# EAGLE design RFID_Lock_PCB (EAGLE 9.4.2)
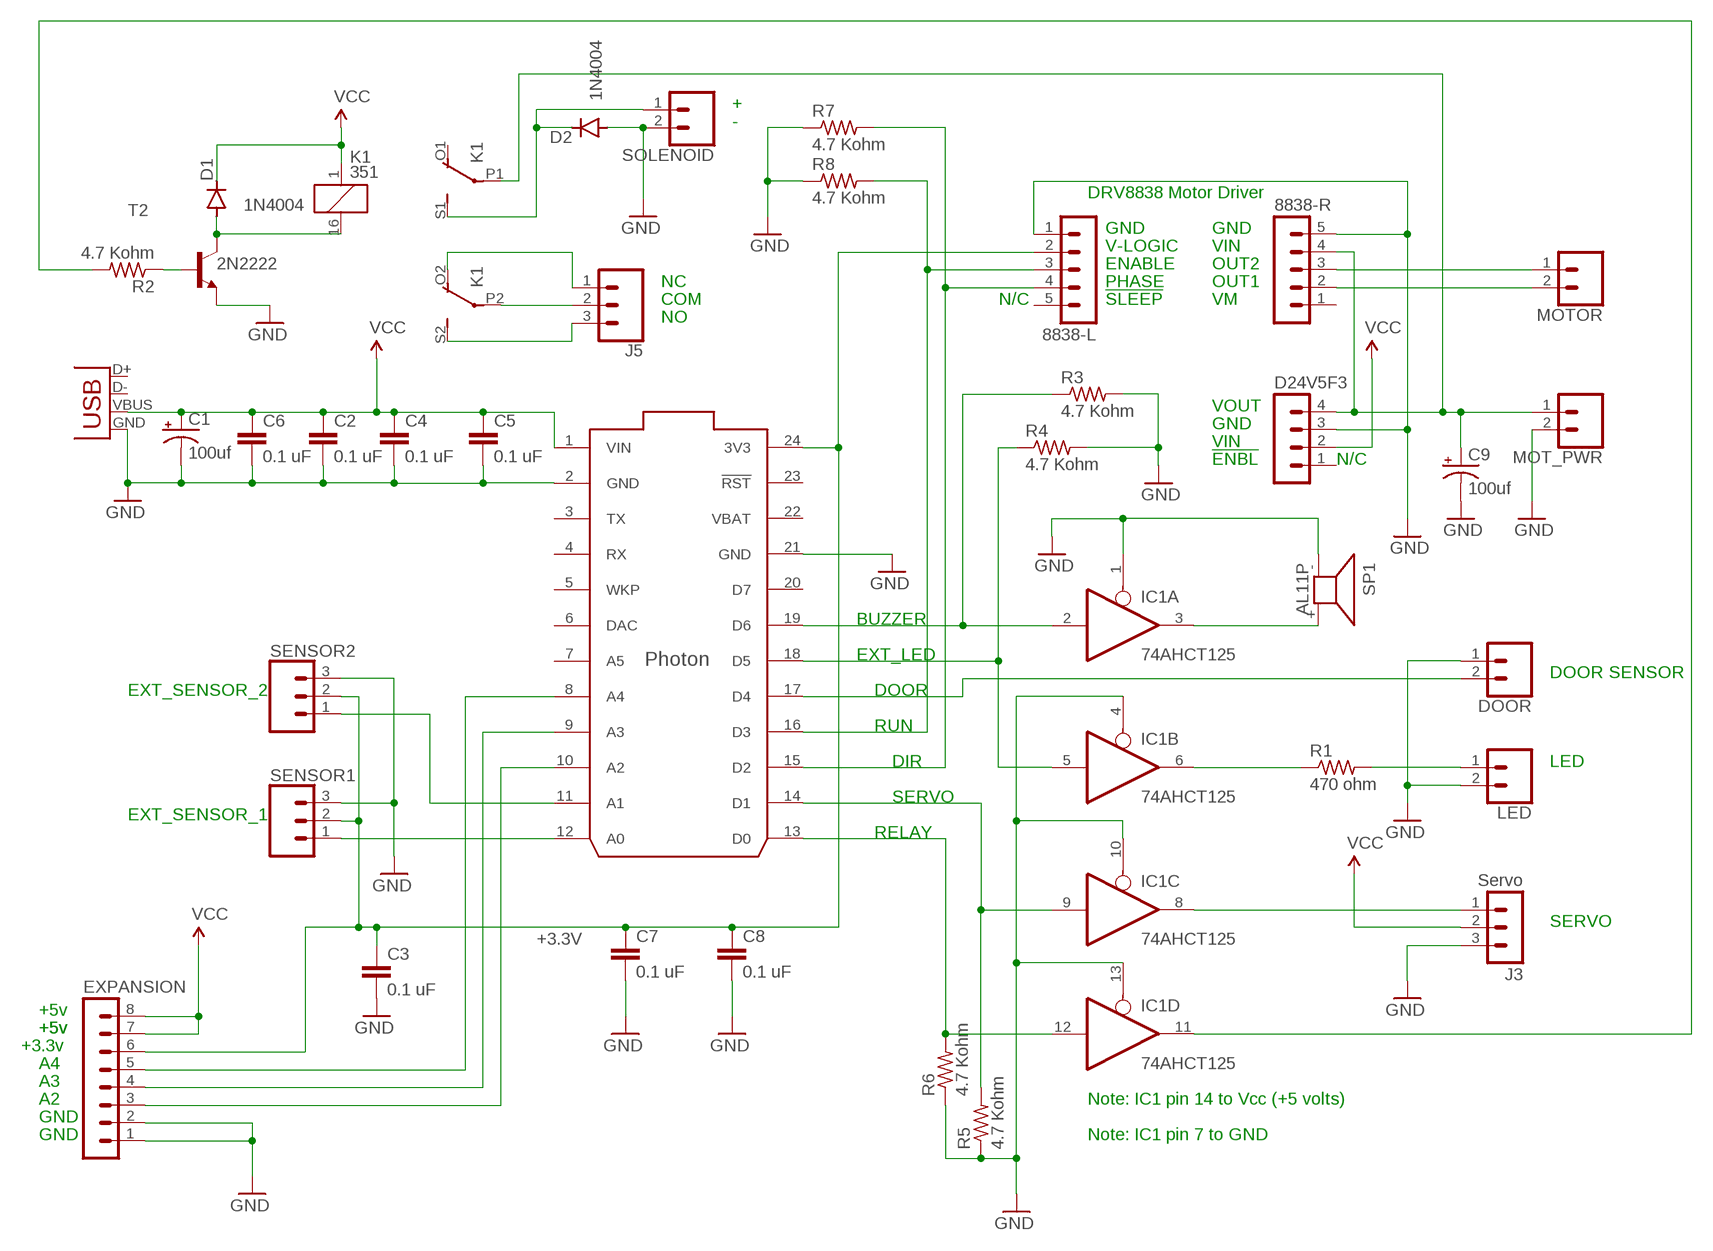
[diagram p0: schematic, sheet 1]

## Parts
8838-L  MA05-1  [MA05-1]
8838-R  MA05-1  [MA05-1]
C1  100uf  CAP_POLPTH1  [CPOL-RADIAL-100UF-25V]
C2  0.1 uF  CAPPTH  [CAP-PTH-SMALL]
C3  0.1 uF  CAPPTH  [CAP-PTH-SMALL]
C4  0.1 uF  CAPPTH  [CAP-PTH-SMALL]
C5  0.1 uF  CAPPTH  [CAP-PTH-SMALL]
C6  0.1 uF  CAPPTH  [CAP-PTH-SMALL]
C7  0.1 uF  CAPPTH  [CAP-PTH-SMALL]
C8  0.1 uF  CAPPTH  [CAP-PTH-SMALL]
C9  100uf  CAP_POLPTH1  [CPOL-RADIAL-100UF-25V]
D1  1N4004  [DO41-10]
D2  1N4004  [DO41-10]
D24V5F3  MA04-1  [MA04-1]
DOOR  CONN_023.5MM  [SCREWTERMINAL-3.5MM-2]
EXPANSION  MA08-1  [MA08-1]
IC1  74AHCT125  74125N  [DIL14]
J3  Servo  MA03-1  [MA03-1]
J5  CONN_03SCREW  [SCREWTERMINAL-3.5MM-3]
JP1  USB-B  USBPTH  [USB-B-PTH]
K1  351  [351]
LED  CONN_023.5MM  [SCREWTERMINAL-3.5MM-2]
MOT_PWR  CONN_023.5MM  [SCREWTERMINAL-3.5MM-2]
MOTOR  CONN_023.5MM  [SCREWTERMINAL-3.5MM-2]
R1  470 ohm  R-US_0309/12  [0309/12]
R2  4.7 Kohm  R-US_0309/12  [0309/12]
R3  4.7 Kohm  R-US_0309/12  [0309/12]
R4  4.7 Kohm  R-US_0309/12  [0309/12]
R5  4.7 Kohm  R-US_0309/12  [0309/12]
R6  4.7 Kohm  R-US_0309/12  [0309/12]
R7  4.7 Kohm  R-US_0309/12  [0309/12]
R8  4.7 Kohm  R-US_0309/12  [0309/12]
SENSOR1  CONN_03SCREW  [SCREWTERMINAL-3.5MM-3]
SENSOR2  CONN_03SCREW  [SCREWTERMINAL-3.5MM-3]
SOLENOID  CONN_023.5MM  [SCREWTERMINAL-3.5MM-2]
SP1  AL11P  [AL11P]
T2  2N2222  [TO92-EBC-OVAL]
U$1  PHOTON_WITH_HEADERS  [PHOTON]

## Nets
+3.3V: 8838-L.2 C3.1 C7.1 C8.1 EXPANSION.6 SENSOR1.2 SENSOR2.2 U$1.24(3V3)
GND: 8838-L.1 8838-R.5 C1.2(-) C2.2 C3.2 C4.2 C5.2 C6.2 C7.2 C8.2 C9.2(-) D2.A D24V5F3.3 DOOR.1 EXPANSION.1 EXPANSION.2 IC1.1(A:OE) IC1.4(B:OE) IC1.10(C:OE) IC1.13(D:OE) J3.3 JP1.GND LED.2 MOT_PWR.2 R3.2 R4.2 R5.1 R6.1 R7.1 R8.1 SENSOR1.3 SENSOR2.3 SOLENOID.2 SP1.- T2.E U$1.2(GND) U$1.21(GND)
N$1: IC1.8(C:O) J3.1
N$2: SENSOR2.1 U$1.11(A1)
N$3: SENSOR1.1 U$1.12(A0)
N$4: IC1.2(A:I) R3.1 U$1.19(D6)
N$5: 8838-L.3 R8.2 U$1.16(D3)
N$6: 8838-R.4 C9.1(+) D24V5F3.4 K1.P1(2:P) MOT_PWR.1
N$7: IC1.9(C:I) R5.2 U$1.14(D1)
N$8: 8838-R.3 MOTOR.1
N$9: IC1.6(B:O) R1.1
N$10: LED.1 R1.2
N$11: DOOR.2 U$1.17(D4)
N$12: 8838-L.4 R7.2 U$1.15(D2)
N$13: 8838-R.2 MOTOR.2
N$14: IC1.3(A:O) SP1.+
N$15: EXPANSION.3 U$1.10(A2)
N$16: EXPANSION.4 U$1.9(A3)
N$17: IC1.12(D:I) R6.2 U$1.13(D0)
N$18: EXPANSION.5 U$1.8(A4)
N$19: IC1.11(D:O) R2.2
N$20: R2.1 T2.B
N$21: D1.A K1.16 T2.C
N$22: D2.C K1.S1(2:S) SOLENOID.1
N$23: IC1.5(B:I) R4.1 U$1.18(D5)
N$26: J5.2 K1.P2(3:P)
N$27: J5.1 K1.O2(3:O)
N$28: J5.3 K1.S2(3:S)
VCC: C1.1(+) C2.1 C4.1 C5.1 C6.1 D1.C D24V5F3.2 EXPANSION.7 EXPANSION.8 J3.2 JP1.VBUS K1.1 U$1.1(VIN)
Unconnected: 8838-L.5 8838-R.1 D24V5F3.1 JP1.D+ JP1.D- K1.O1(2:O) U$1.3(TX) U$1.4(RX) U$1.5(WKP) U$1.6(DAC) U$1.7(A5) U$1.20(D7) U$1.23(!RST)

## Notes on the sheet
- +
- -
- DRV8838 Motor Driver
- GND | GND
- V-LOGIC | VIN
- ENABLE | OUT2
- NC | PHASE | OUT1
- COM | N/C | !SLEEP | VM
- NO
- VOUT
- GND
- VIN
- !ENBL | N/C
- BUZZER
- EXT_LED
- DOOR SENSOR
- EXT_SENSOR_2 | DOOR
- RUN
- DIR | LED
- SERVO
- EXT_SENSOR_1
- RELAY
- SERVO
- +5v
- +5v | +5v
- +3.3v
- A4
- A3
- A2 | Note: IC1 pin 14 to Vcc (+5 volts)
- GND
- GND | Note: IC1 pin 7 to GND

## Power pins joined to a net without a drawn wire
GND: IC1.7(P:GND)
VBAT: U$1.22(VBAT)
VCC: IC1.14(P:VCC)

## Library data of the parts
8838-L 8838-R = con-lstb:MA05-1: PIN HEADER; OC_FARNELL: unknown; OC_NEWARK: unknown
C1 C9 = SparkFun-Capacitors:CAP_POL: Capacitor Polarized These are standard SMD and PTH capacitors. Normally 10uF, 47uF, and 100uF in electrolytic and tantalum varieties. Always verify the external diameter of the through hole cap, it varies with capacity, voltage, and manufacturer. The EIA devices should be standard.
C2-C8 = SparkFun-Passives:CAP: Capacitor Standard 0603 ceramic capacitor, and 0.1" leaded capacitor.
D1 D2 = diode:1N4004: DIODE general purpose rectifier, 1 A
D24V5F3 = con-lstb:MA04-1: PIN HEADER; OC_FARNELL: unknown; OC_NEWARK: unknown
DOOR LED MOT_PWR MOTOR SOLENOID = SparkFun-Connectors:CONN_02: Multi connection point. Often used as Generic Header-pin footprint for 0.1 inch spaced/style header connections On any of the 0.1 inch spaced packages, you can populate with these: Break Away Headers - Straight <https://www.sparkfun.com/products/116> (PRT-00116) Break Away Male Headers - Right Angle <https://www.sparkfun.com/products/553> (PRT-00553) Female Headers <https://www.sparkfun.com/products/115> (PRT-00115) Break Away Headers - Machine Pin <https://www.sparkfun.com/products/117> (PRT-00117) Break Away Female Headers - Swiss Machine Pin <https://www.sparkfun.com/products/743> (PRT-00743) For SCREWTERMINALS and SPRING TERMINALS visit here: Screw Terimnals on SparkFun.com <https://www.sparkfun.com/search/results?term=Screw+Terminals> (5mm/3.5mm/2.54mm spacing) This device is also useful as a general connection point to wire up your design to another part of your project. Our various solder wires solder well into these plated through hole pads. Hook-Up Wire - Assortment (Stranded, 22 AWG) <https://www.sparkfun.com/products/11375> (PRT-11375) Hook-Up Wire - Assortment (Solid Core, 22 AWG) <https://www.sparkfun.com/products/11367> (PRT-11367) View the entire wire category on our website here <https://www.sparkfun.com/categories/141> Special notes: Molex polarized connector foot print use with: PRT-08233 with associated crimp pins and housings. 2.54_SCREWTERM for use with PRT-10571. 3.5mm Screw Terminal footprints for PRT-08084 5mm Screw Terminal footprints for use with PRT-08432; PROD_ID: CONN-08399
EXPANSION = con-lstb:MA08-1: PIN HEADER; OC_FARNELL: unknown; OC_NEWARK: unknown
IC1 = 74xx-us:74*125: Quad bus BUFFER, 3-state
J3 = con-lstb:MA03-1: PIN HEADER; OC_FARNELL: unknown; OC_NEWARK: unknown
J5 SENSOR1 SENSOR2 = SparkFun-Connectors:CONN_03: Multi connection point. Often used as Generic Header-pin footprint for 0.1 inch spaced/style header connections On any of the 0.1 inch spaced packages, you can populate with these: Break Away Headers - Straight <https://www.sparkfun.com/products/116> (PRT-00116) Break Away Male Headers - Right Angle <https://www.sparkfun.com/products/553> (PRT-00553) Female Headers <https://www.sparkfun.com/products/115> (PRT-00115) Break Away Headers - Machine Pin <https://www.sparkfun.com/products/117> (PRT-00117) Break Away Female Headers - Swiss Machine Pin <https://www.sparkfun.com/products/743> (PRT-00743) Stackable Header - 3 Pin (Female, 0.1") <https://www.sparkfun.com/products/13875> (PRT-13875) For SCREWTERMINALS and SPRING TERMINALS visit here: Screw Terimnals on SparkFun.com <https://www.sparkfun.com/search/results?term=Screw+Terminals> (5mm/3.5mm/2.54mm spacing) This device is also useful as a general connection point to wire up your design to another part of your project. Our various solder wires solder well into these plated through hole pads. Hook-Up Wire - Assortment (Stranded, 22 AWG) <https://www.sparkfun.com/products/11375> (PRT-11375) Hook-Up Wire - Assortment (Solid Core, 22 AWG) <https://www.sparkfun.com/products/11367> (PRT-11367) View the entire wire category on our website here <https://www.sparkfun.com/categories/141> Special notes: Molex polarized connector foot print use with SKU : PRT-08232 with associated crimp pins and housings.; PROD_ID: CONN-08288; SF_ID: PRT-08235
JP1 = SparkFun-Connectors:USB: USB Connectors USB-B-PTH is fully proven SKU : PRT-00139/CONN-08278 USB-miniB is fully proven SKU : PRT-00587 USB-A-PCB is untested. USB-A-H is throughly reviewed, but untested. Spark Fun Electronics SKU : PRT-00437 USB-B-SMT is throughly reviewed, but untested. Needs silkscreen touching up. USB-A-S has not been used/tested USB-MB-H has not been used/tested USB-MICROB has been used. CONN-09505; PROD_ID: CONN-08278
K1 = relay:351: RELAY 2 x switch, Omron; OC_FARNELL: unknown; OC_NEWARK: unknown
R1-R8 = rcl:R-US_: RESISTOR, American symbol
SP1 = buzzer:AL11P: SPEAKER Source: Buerklin; OC_FARNELL: unknown; OC_NEWARK: unknown
T2 = adafruit:2N2222: NPN TRANSISTOR Big oval pads
U$1 = Spark:PHOTON

## Board
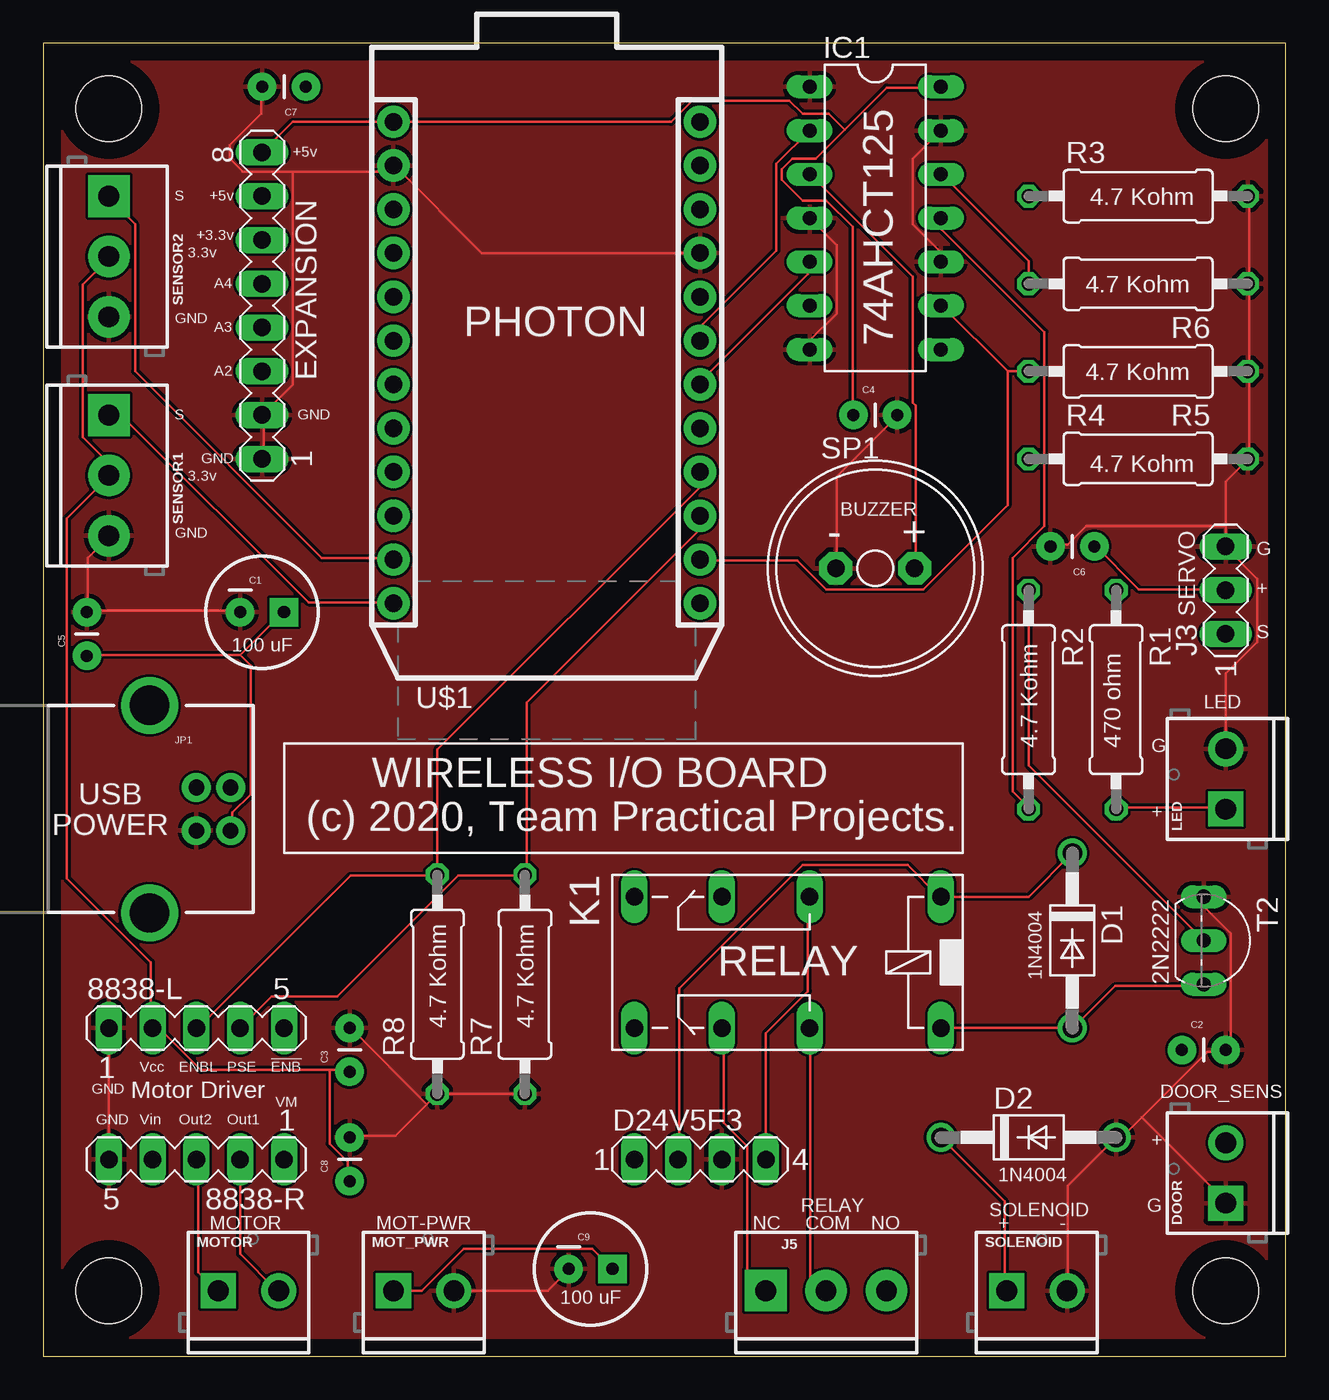
[diagram p1: board, top side]
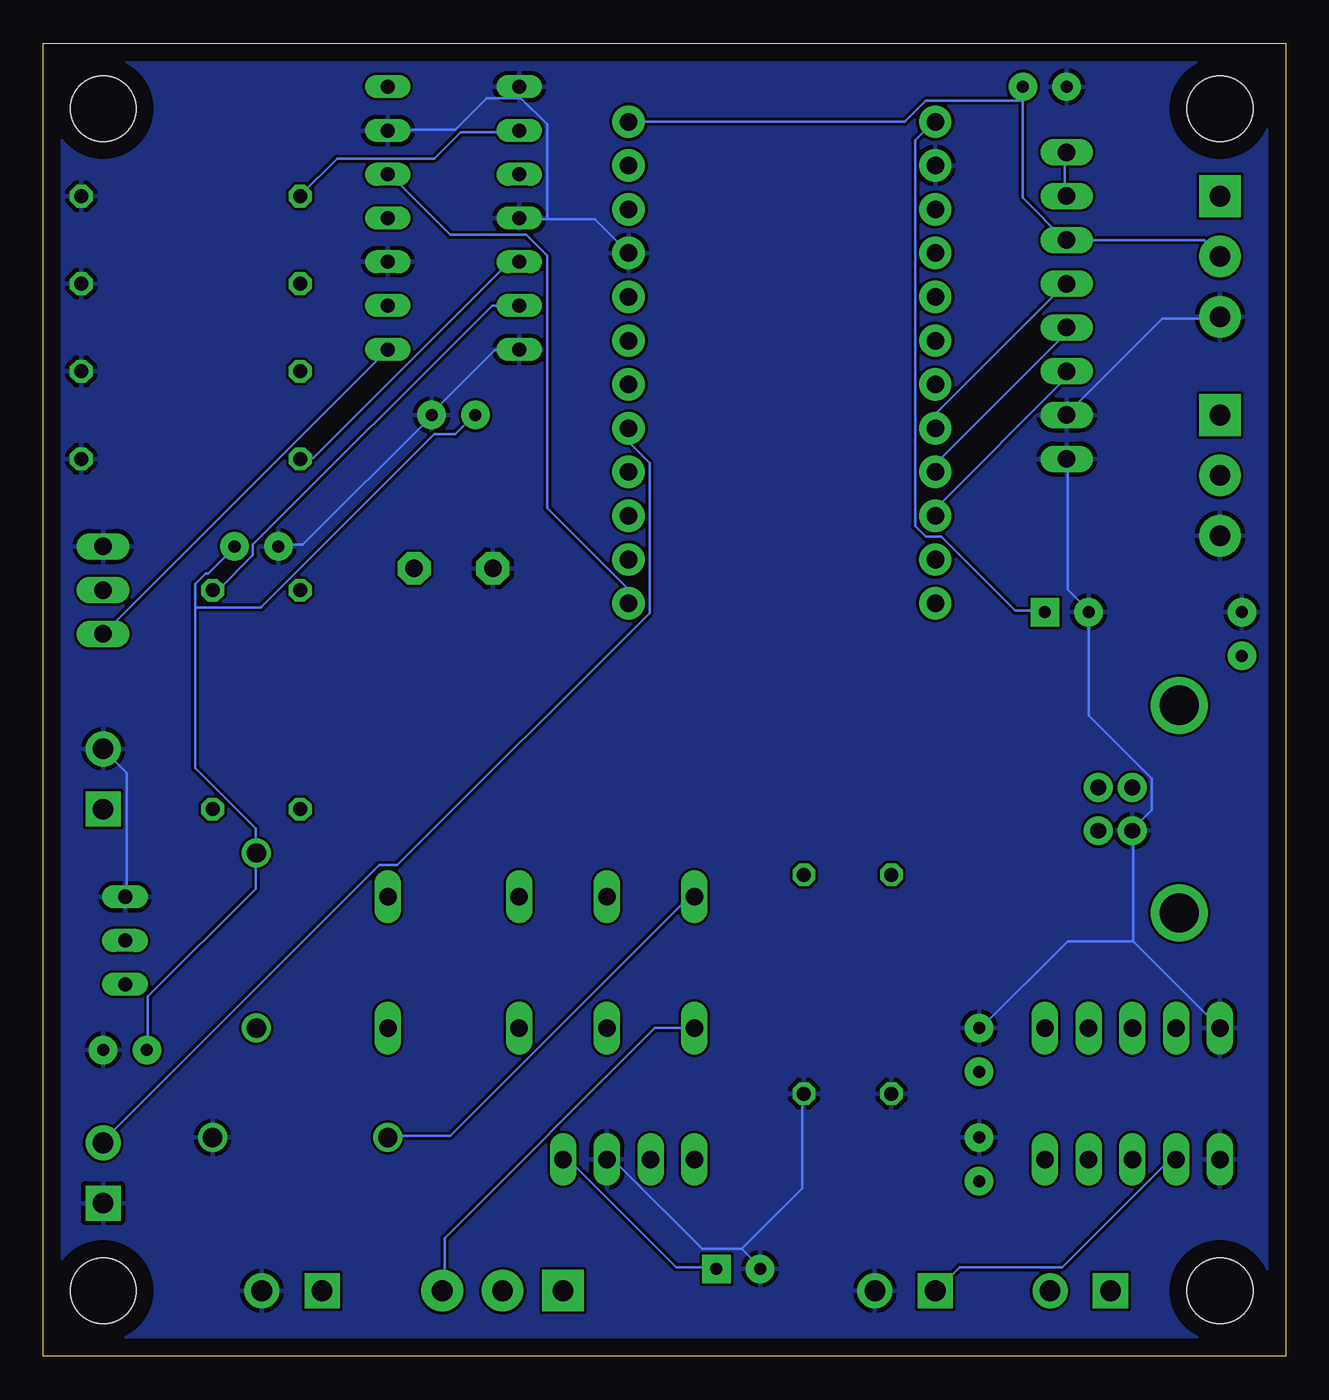
[diagram p2: board, bottom side, seen from below]

Size 72.06 x 76.19 mm. Coordinates in mm from the lower left corner, seen from the top.
Outline: 0,0 72.06,0 72.06,76.19 0,76.19 0,0
Copper layers (1*16): Top 0.035mm / dielectric 1.5mm / Bottom 0.035mm
Design rules "default": minimum track width 6mil, minimum drill 0.35mm, track to track 6mil, track to pad 6mil, pad to pad 6mil, via to via 6mil, smd to smd 6mil, copper to edge 40mil, drill to drill 6mil, minimum pad ring 10mil, minimum via ring 8mil, stop-mask expansion 4mil, vias tented up to drill 0mil, thermal gap 10mil
Holes 3.8 mm at 3.81,72.39 68.58,72.39 3.81,3.81 68.58,3.81

### Footprints (pad centres in the part's own frame; a part is rotated, then mirrored left to right if it is on the bottom)
MA05-1 = drill 1.016 long: 1 -5.08,0; 2 -2.54,0; 3 0,0; 4 2.54,0; 5 5.08,0
CPOL-RADIAL-100UF-25V = drill 0.7 pad 1.651 square: 1 1.27,0 | drill 0.7 pad 1.651: 2 -1.27,0
CAP-PTH-SMALL = drill 0.7 pad 1.651: 1 0,0; 2 2.54,0
DO41-10 = drill 1.118: A 5.08,0; C -5.08,0
MA04-1 = drill 1.016 long: 1 -3.81,0; 2 -1.27,0; 3 1.27,0; 4 3.81,0
SCREWTERMINAL-3.5MM-2 = drill 1.2 pad 2.032 square: 1 0,0 | drill 1.2 pad 2.032: 2 3.5,0
MA08-1 = drill 1.016 long: 1 -8.89,0; 2 -6.35,0; 3 -3.81,0; 4 -1.27,0; 5 1.27,0; 6 3.81,0; 7 6.35,0; 8 8.89,0
DIL14 = drill 0.813 long: 1 -7.62,-3.81; 2 -5.08,-3.81; 3 -2.54,-3.81; 4 0,-3.81; 5 2.54,-3.81; 6 5.08,-3.81; 7 7.62,-3.81; 8 7.62,3.81; 9 5.08,3.81; 10 2.54,3.81; 11 0,3.81; 12 -2.54,3.81; 13 -5.08,3.81; 14 -7.62,3.81
MA03-1 = drill 1.016 long: 1 -2.54,0; 2 0,0; 3 2.54,0
SCREWTERMINAL-3.5MM-3 = drill 1.2 pad 2.413 square: 1 0,0 | drill 1.2 pad 2.413: 2 3.5,0; 3 7,0
USB-B-PTH = drill 0.914 pad 1.676: D+ 0,1.25; D- 1.981,1.25; GND 0,-1.25; VBUS 1.981,-1.25 | drill 2.286: S1 -2.718,-6.02; S2 -2.718,6.02
351 = drill 1.016 long: 1 -3.81,-3.81; 16 -3.81,3.81; O1 8.89,-3.81; O2 8.89,3.81; P1 3.81,-3.81; P2 3.81,3.81; S1 13.97,-3.81; S2 13.97,3.81
0309/12 = drill 0.813 octagon: 1 -6.35,0; 2 6.35,0
AL11P = drill 1.016 pad 1.905 octagon: + 2.286,0; - -2.286,0
TO92-EBC-OVAL = drill 0.813 long: B 0,-1.27; C 2.54,-1.27; E -2.54,-1.27
PHOTON = drill 1.016 pad 1.88: 1 1.27,32.258; 2 1.27,29.718; 3 1.27,27.178; 4 1.27,24.638; 5 1.27,22.098; 6 1.27,19.558; 7 1.27,17.018; 8 1.27,14.478; 9 1.27,11.938; 10 1.27,9.398; 11 1.27,6.858; 12 1.27,4.318; 13 19.05,4.318; 14 19.05,6.858; 15 19.05,9.398; 16 19.05,11.938; 17 19.05,14.478; 18 19.05,17.018; 19 19.05,19.558; 20 19.05,22.098; 21 19.05,24.638; 22 19.05,27.178; 23 19.05,29.718; 24 19.05,32.258

### Placement (x,y rotation side)
8838-L  8.89,19.05 0 top
8838-R  8.89,11.43 180 top
C1  12.7,43.18 0 top
C2  66.04,17.78 0 top
C3  17.78,16.51 90 top
C4  46.99,54.61 0 top
C5  2.54,40.64 90 top
C6  60.96,46.99 180 top
C7  15.24,73.66 180 top
C8  17.78,10.16 90 top
C9  31.75,5.08 0 top
D1  59.69,24.13 270 top
D2  57.15,12.7 0 top
D24V5F3  38.1,11.43 0 top
DOOR  68.58,8.89 90 top
EXPANSION  12.7,60.96 90 top
IC1  48.26,66.04 270 top
J3  68.58,44.45 90 top
J5  41.91,3.81 0 top
JP1  8.89,31.75 0 top
K1  48.26,22.86 180 top
LED  68.58,31.75 90 top
MOT_PWR  20.32,3.81 0 top
MOTOR  10.16,3.81 0 top
R1  62.23,38.1 270 top
R2  57.15,38.1 270 top
R3  63.5,67.31 0 top
R4  63.5,52.07 0 top
R5  63.5,57.15 180 top
R6  63.5,62.23 180 top
R7  27.94,21.59 90 top
R8  22.86,21.59 90 top
SENSOR1  3.81,54.61 270 top
SENSOR2  3.81,67.31 270 top
SOLENOID  55.88,3.81 0 top
SP1  48.26,45.72 0 top
T2  68.58,24.13 270 top
U$1  19.05,39.37 0 top

### Tracks (layer width: path | path; a pad name or v marks a point on that pad's centre or on a via)
+3.3V
  Top 0.152: 16.61,16.61 17.68,16.61 C3.1 | 16.61,16.61 9.14,16.61 6.71,19.05 8838-L.2 6.25,19.05 6.25,22.86 1.37,27.74 1.37,48.62 3.81,51.05 SENSOR1.2 3.81,51.82 2.29,53.34 2.29,62.18 3.81,63.7 SENSOR2.2 | 16.61,16.61 16.61,12.34 17.68,11.28 17.68,10.21 C8.1
  Bottom 0.152: SENSOR2.2 3.81,63.86 4.72,64.77 EXPANSION.6 12.8,64.77 15.24,67.21 15.24,72.85 | 15.24,72.85 C7.1 15.24,73.61 | U$1.24 22.1,71.63 20.88,72.85 15.24,72.85
GND
  Top 0.152: 63.7,13.87 62.64,12.8 62.33,12.8 D2.A 59.44,9.91 59.44,3.81 SOLENOID.2 | 63.7,13.87 67.51,17.68 68.58,17.68 C2.2 68.58,17.83 68.89,18.14 68.89,24.54 67.36,26.06 67.36,26.67 T2.E | 63.7,13.87 68.58,8.99 DOOR.1 | R3.2 69.95,67.21 69.95,62.33 R6.1 69.95,62.18 69.95,57.15 | 69.95,57.15 69.95,52.12 R4.2 69.8,51.97 68.58,50.75 68.58,48.16 | 68.58,48.16 J3.3 68.58,46.94 70.41,45.11 70.41,41.45 68.58,39.62 LED.2 | 68.58,48.16 60.5,48.16 59.44,47.09 58.52,47.09 C6.2 | 69.95,57.15 R5.1 | SP1.- 46.02,45.72 46.02,51.05 49.53,54.56 C4.2 | IC1.13 50.44,69.49 50.44,65.68 51.97,64.16 51.97,63.55 IC1.10 | IC1.4 46.02,64.47 46.02,60.5 44.5,58.98 44.5,58.52 IC1.7 | 14.48,68.73 19.96,68.73 U$1.2 20.42,69.04 25.45,64.01 U$1.21 | 14.48,68.73 11.58,68.73 10.82,69.49 10.82,70.26 12.65,72.08 12.65,73.61 C7.2 | EXPANSION.1 12.8,52.12 12.8,54.56 EXPANSION.2 14.48,56.39 14.48,68.73 | 2.59,43.28 2.59,46.33 3.81,47.55 SENSOR1.3 | 2.59,43.28 11.43,43.28 C1.2 | 2.59,43.28 C5.2 | 8838-L.1 8838-R.5 | R7.1 R8.1 22.25,14.63 | 22.25,14.63 20.42,12.8 17.83,12.8 C8.2 | 22.25,14.63 17.83,19.05 C3.2 | MOT_PWR.2 29.26,3.81 30.48,5.03 C9.2
  Bottom 0.152: T2.E 67.21,26.67 67.21,33.83 68.58,35.2 LED.2 | IC1.7 44.5,58.37 45.87,58.37 49.53,54.71 C4.2 49.53,54.56 57,47.09 58.37,47.09 C6.2 | 42.82,65.99 40.08,65.99 U$1.21 | 42.82,65.99 44.35,65.99 IC1.4 | 44.35,73 44.35,73.61 IC1.1 | 44.35,73 42.82,71.48 42.82,65.99 | 44.35,73 46.33,73 48.16,71.17 51.97,71.17 IC1.13 | EXPANSION.1 12.65,51.97 12.65,44.5 11.43,43.28 C1.2 11.43,37.19 7.77,33.53 7.77,31.7 8.84,30.63 JP1.GND 8.84,30.48 8.84,24.08 | SENSOR2.3 3.81,60.2 7.16,60.2 12.65,54.71 EXPANSION.2 | 8838-L.1 8.84,24.08 | D24V5F3.3 39.01,11.43 33.83,6.25 31.55,6.25 | 31.55,6.25 30.48,5.18 C9.2 | 31.55,6.25 28.04,9.75 28.04,15.24 R7.1 | 8.84,24.08 12.65,24.08 17.68,19.05 C3.2
  pour Bottom: 0,0 0,76.2 72.39,76.2 72.39,0
  pour Top: 0,0 0,76.2 72.39,76.2 72.39,0
N$1
  Bottom 0.152: J3.1 IC1.8
N$2
  Top 0.152: U$1.11 20.27,46.33 16.15,46.33 5.33,57.15 5.33,65.68 3.81,67.21 SENSOR2.1
N$3
  Top 0.152: U$1.12 20.27,43.74 15.39,43.74 4.57,54.56 3.81,54.56 SENSOR1.1
N$4
  Top 0.152: U$1.19 38.1,59.74 42.52,64.16 42.52,69.19 IC1.2
  Bottom 0.152: IC1.2 44.5,71.02 47.85,71.02 49.38,69.49 55.02,69.49 57.15,67.36 R3.1
N$5
  Top 0.152: 8838-L.3 8.99,19.05 17.83,27.89 22.86,27.89 R8.2 22.86,35.2 38.1,50.44 U$1.16
N$6
  Top 0.152: D24V5F3.4 41.91,18.75 44.35,21.18 44.35,26.67 K1.P1 | MOT_PWR.1 21.95,3.81 24.38,6.25 31.85,6.25 C9.1
  Bottom 0.152: 8838-R.4 6.71,11.43 12.95,5.18 18.9,5.18 20.27,3.81 MOT_PWR.1 | D24V5F3.4 41.6,11.43 35.36,5.18 33.07,5.18 C9.1
N$7
  Top 0.152: 55.93,57.15 R5.2 | 55.93,57.15 52.12,60.96 IC1.9 | 55.93,57.15 55.93,49.38 51.05,44.5 45.41,44.5 43.74,46.18 38.1,46.18 U$1.14
N$8
  Top 0.152: 8838-R.3 8.99,11.43 8.99,4.88 10.06,3.81 MOTOR.1
N$9
  Bottom 0.152: IC1.6 46.02,60.96 59.89,47.09 59.89,46.48 61.87,44.5 62.18,44.5 R1.1
N$10
  Top 0.152: R1.2 62.33,31.85 68.58,31.85 LED.1
N$11
  Bottom 0.152: U$1.17 38.1,53.03 36.88,51.82 36.88,43.13 51.51,28.5 52.58,28.5 68.58,12.5 DOOR.2
N$12
  Top 0.152: 8838-L.4 13.26,20.88 17.07,20.88 24.08,27.89 27.89,27.89 R7.2 28.04,28.04 28.04,37.95 38.1,48.01 U$1.15
N$13
  Top 0.152: 8838-R.2 11.43,5.94 13.56,3.81 MOTOR.2
N$14
  Top 0.152: IC1.3 44.5,68.58 50.44,62.64 50.44,55.32 50.6,55.17 50.6,45.72 SP1.+
N$15
  Bottom 0.152: EXPANSION.3 12.8,57.15 12.8,56.69 20.27,49.23 20.27,48.77 U$1.10
N$16
  Bottom 0.152: EXPANSION.4 12.8,59.59 12.8,59.28 20.27,51.82 20.27,51.36 U$1.9
N$17
  Top 0.152: R6.2 57.15,63.55 52.12,68.58 IC1.12
  Bottom 0.152: U$1.13 38.1,44.5 42.82,49.23 42.82,63.86 44.04,65.08 48.46,65.08 51.97,68.58 IC1.12
N$18
  Bottom 0.152: EXPANSION.5 12.8,62.18 20.27,54.71 20.27,53.95 U$1.8
N$19
  Top 0.152: IC1.11 52.12,65.99 52.12,65.38 58.06,59.44 58.06,48.16 56.24,46.33 56.24,32.77 57.15,31.85 R2.2
N$20
  Top 0.152: R2.1 57.15,34.29 T2.B
N$21
  Top 0.152: T2.C 67.21,21.49 62.18,21.49 59.74,19.05 D1.A K1.16
N$22
  Top 0.152: D2.C 55.78,8.99 55.78,3.81 SOLENOID.1
  Bottom 0.152: K1.S1 34.59,26.67 48.46,12.8 51.97,12.8 D2.C
N$23
  Top 0.152: U$1.18 38.1,56.54 44.35,62.79 44.35,63.4 IC1.5
  Bottom 0.152: R4.1 57.15,52.12 56.39,52.12 45.11,63.4 44.5,63.4 IC1.5
N$26
  Top 0.152: K1.P2 44.5,19.05 44.5,4.57 45.26,3.81 J5.2
N$27
  Top 0.152: J5.1 40.84,4.88 40.84,12.19 39.47,13.56 39.47,19.05 K1.O2
N$28
  Bottom 0.152: K1.S2 36.58,19.05 48.77,6.86 48.77,3.81 J5.3
VCC
  Top 0.152: D24V5F3.2 36.88,11.43 36.88,21.34 44.04,28.5 50.14,28.5 51.97,26.67 K1.1 57.15,26.67 D1.C | J3.2 68.58,44.5 63.55,44.5 60.96,47.09 C6.1 | 11.43,40.69 2.59,40.69 C5.1 | 11.43,40.69 13.87,43.13 C1.1 | 11.43,40.69 12.04,40.08 12.04,32.61 10.97,31.55 10.97,30.63 JP1.VBUS | EXPANSION.8 14.48,71.63 U$1.1 36.42,71.63 37.64,72.85 43.28,72.85 44.04,72.08 45.57,72.08 46.48,71.17 | 46.48,71.17 44.81,69.49 43.43,69.49 42.82,68.89 42.82,68.28 44.04,67.06 45.41,67.06 46.94,65.53 46.94,54.71 C4.1 | 46.48,71.17 48.92,73.61 51.97,73.61 IC1.14
  Bottom 0.152: C2.1 65.99,17.83 65.99,20.88 59.74,27.13 59.74,29.11 D1.C 59.74,29.26 59.74,30.63 63.25,34.14 63.25,43.43 | 63.25,43.43 63.25,44.81 62.64,45.41 62.48,45.41 60.96,46.94 C6.1 | EXPANSION.7 12.8,67.36 12.8,69.8 EXPANSION.8 | C1.1 14.02,43.28 15.7,43.28 19.96,47.55 20.88,47.55 21.49,48.16 21.49,70.56 20.42,71.63 U$1.1 | 63.25,43.43 59.44,43.43 49.38,53.49 48.16,53.49 47.09,54.56 C4.1

### Text on the board
tPlace: 74AHCT125 | +5v | S | +5v | 4.7 Kohm | +3.3v | 3.3v | A4 | 4.7 Kohm | GND | A3 | PHOTON | A2 | 4.7 Kohm | S | GND | GND | 3.3v | 4.7 Kohm | BUZZER | GND | - | + | G | + | SERVO | S | 100 uF | LED | 4.7 Kohm | 470 ohm | G | WIRELESS I/O BOARD | USB | + | POWER | (c) 2020, Team Practical Projects. | RELAY | 1N4004 | 2N2222 | 4.7 Kohm | 4.7 Kohm | Vcc | ENBL | PSE | !ENB | GND | Motor Driver | DOOR_SENS | VM | GND | Vin | Out2 | Out1 | + | 1N4004 | RELAY | SOLENOID | G | MOTOR | MOT-PWR | NC | COM | NO | + | - | 100 uF